# EAGLE design powersupply_vol6 (EAGLE 9.6.2)
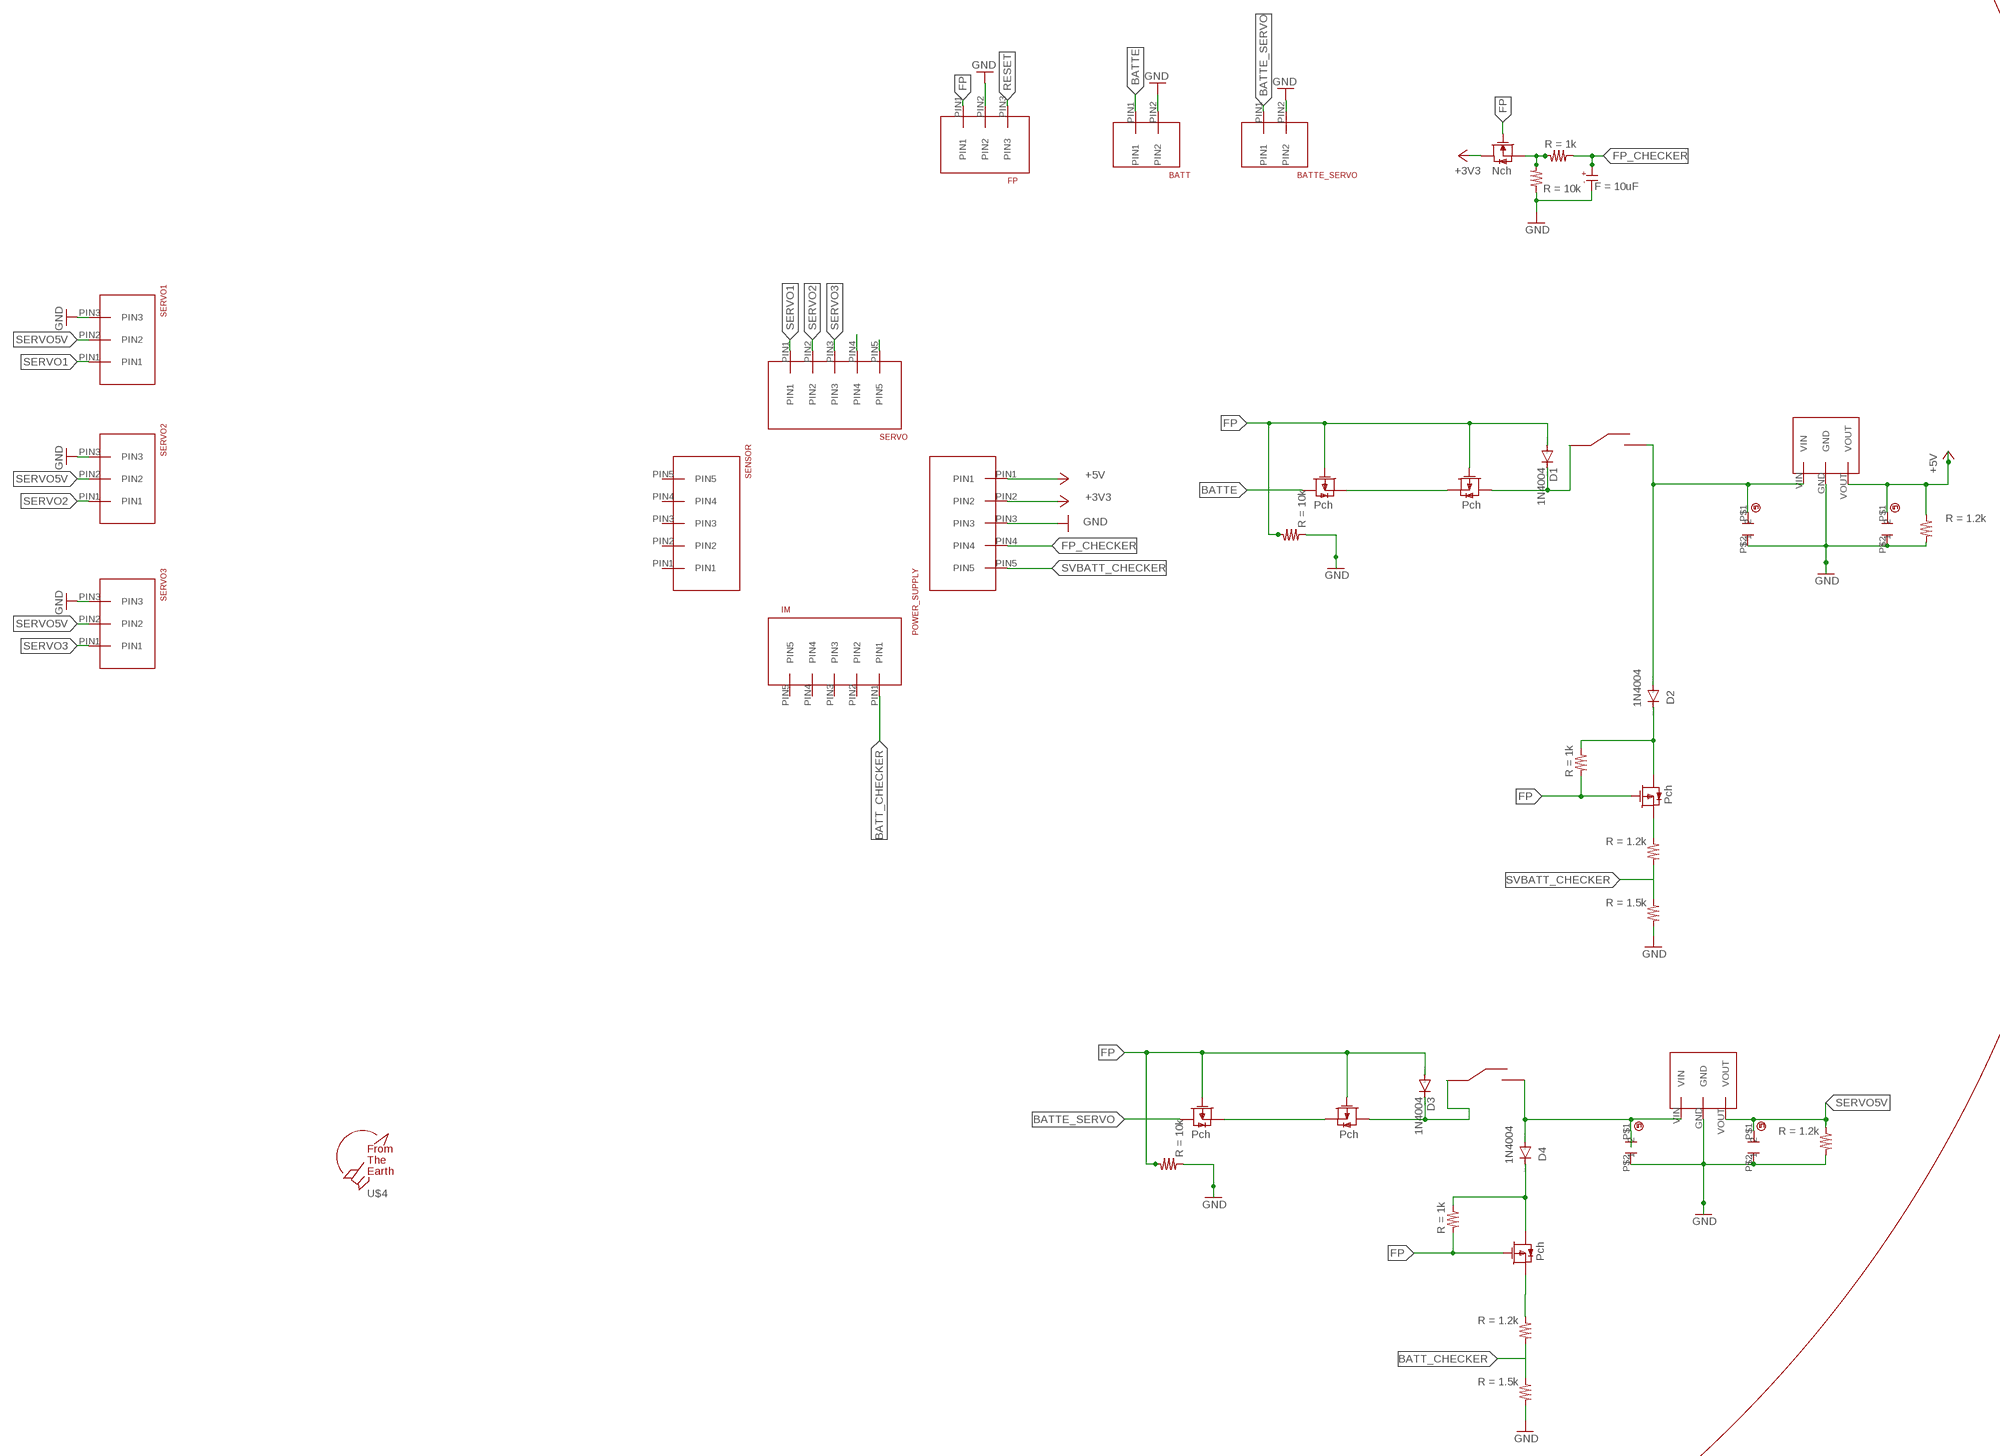
[diagram p0: schematic, sheet 1]

## Parts
BATT  2PIN  [2PIN]
BATTE_SERVO  2PIN  [2PIN]
C1  CAPACITOR-ELECTROLYTIC_1  [CAPACITOR-ELECTROLYTIC_1]
CERAMIC_CAPACITOR3  CERAMIC_CAPACITOR  [CERAMIC_CAPACITOR]
CERAMIC_CAPACITOR4  CERAMIC_CAPACITOR  [CERAMIC_CAPACITOR]
CERAMIC_CAPACITOR5  CERAMIC_CAPACITOR  [CERAMIC_CAPACITOR]
CERAMIC_CAPACITOR6  CERAMIC_CAPACITOR  [CERAMIC_CAPACITOR]
D1  1N4004  [DO41-10]
D2  1N4004  [DO41-10]
D3  1N4004  [DO41-10]
D4  1N4004  [DO41-10]
FP  3PIN  [3PIN]
IM  5PIN  [5PIN]
POWER_SUPPLY  5PIN  [5PIN]
R1  1.5k  RESISTER  [REGISTER]
R2  RESISTER  [REGISTER]
R3  RESISTER  [REGISTER]
R4  1.5k  RESISTER  [REGISTER]
R5  RESISTER  [REGISTER]
R6  RESISTER  [REGISTER]
R7  RESISTER  [REGISTER]
R8  RESISTER  [REGISTER]
R9  RESISTER  [REGISTER]
R10  RESISTER  [REGISTER]
R11  RESISTER  [REGISTER]
R12  RESISTER  [REGISTER]
SENSOR  5PIN  [5PIN]
SERVO  5PIN  [5PIN]
SERVO1  3PIN  [3PIN]
SERVO2  3PIN  [3PIN]
SERVO3  3PIN  [3PIN]
U$1  2SJ681-PCH  [2SJ681]
U$2  SLIDESWITCH  [SLIDESWITCH]
U$3  SLIDESWITCH  [SLIDESWITCH]
U$4  F.T.E.LOGO  [LOGO]
U$5  2SJ681-PCH  [2SJ681]
U$8  2SK4017-NCH  [2SK4017]
U$12  2SJ681-PCH  [2SJ681]
U$13  2SJ681-PCH  [2SJ681]
U$14  M78AR05-1  [M78AR05-1]
U$30  2SJ681-PCH  [2SJ681]
U$31  2SJ681-PCH  [2SJ681]
U$32  M78AR05-1  [M78AR05-1]

## Nets
+3V3: POWER_SUPPLY.PIN2 U$8.DRAIN
+5V: CERAMIC_CAPACITOR5.P$1 POWER_SUPPLY.PIN1 R11.A U$32.VOUT
BATT_CHECKER: IM.PIN1 R1.A R3.B
BATTE: BATT.PIN1 U$30.DRAIN
BATTE_SERVO: BATTE_SERVO.PIN1 U$13.DRAIN
FP: D1.A D3.A FP.PIN1 R2.B R5.B R7.B R8.B U$1.GATE U$5.GATE U$8.GATE U$12.GATE U$13.GATE U$30.GATE U$31.GATE
FP_CHECKER: C1.KS POWER_SUPPLY.PIN4 R10.A
GND: BATT.PIN2 BATTE_SERVO.PIN2 C1.AN CERAMIC_CAPACITOR3.P$2 CERAMIC_CAPACITOR4.P$2 CERAMIC_CAPACITOR5.P$2 CERAMIC_CAPACITOR6.P$2 FP.PIN2 POWER_SUPPLY.PIN3 R1.B R2.A R4.B R5.A R9.A R11.B R12.B SERVO1.PIN3 SERVO2.PIN3 SERVO3.PIN3 U$14.GND U$32.GND
N$1: D2.C R7.A U$1.DRAIN
N$2: U$12.SOURCE U$13.SOURCE
N$3: R6.A U$1.SOURCE
N$4: D4.C R8.A U$5.DRAIN
N$5: R9.B R10.B U$8.SOURCE
N$6: CERAMIC_CAPACITOR4.P$1 D4.A U$3.C U$14.VIN
N$7: SERVO.PIN4
N$8: SERVO.PIN5
N$9: R3.A U$5.SOURCE
N$10: D1.C U$2.A U$31.DRAIN
N$11: D3.C U$3.A U$12.DRAIN
N$22: U$30.SOURCE U$31.SOURCE
N$24: CERAMIC_CAPACITOR6.P$1 D2.A U$2.C U$32.VIN
RESET: FP.PIN3
SERVO1: SERVO1.PIN1 SERVO.PIN1
SERVO2: SERVO2.PIN1 SERVO.PIN2
SERVO3: SERVO3.PIN1 SERVO.PIN3
SERVO5V: CERAMIC_CAPACITOR3.P$1 R12.A SERVO1.PIN2 SERVO2.PIN2 SERVO3.PIN2 U$14.VOUT
SVBATT_CHECKER: POWER_SUPPLY.PIN5 R4.A R6.B
Unconnected: IM.PIN2 IM.PIN3 IM.PIN4 IM.PIN5 SENSOR.PIN1 SENSOR.PIN2 SENSOR.PIN3 SENSOR.PIN4 SENSOR.PIN5 U$2.B U$3.B

## Library data of the parts
BATT BATTE_SERVO = connectors:2PIN
C1 = normal capacitor:CAPACITOR-ELECTROLYTIC_1; F: 10uF
CERAMIC_CAPACITOR3-CERAMIC_CAPACITOR6 = capacitor:CERAMIC_CAPACITOR: ceramic_capacitor
D1-D4 = diode:1N4004: DIODE general purpose rectifier, 1 A
FP SERVO1-SERVO3 = connectors:3PIN
IM POWER_SUPPLY SENSOR SERVO = connectors:5PIN
R1 R4 = normal register:RESISTER; R: 1.5k
R2 R5 R9 = normal register:RESISTER; R: 10k
R3 R6 R11 R12 = normal register:RESISTER; R: 1.2k
R7 R8 R10 = normal register:RESISTER; R: 1k
U$1 U$5 U$12 U$13 U$30 U$31 = MOSFET:2SJ681-PCH
U$2 U$3 = SLIDESWITCH:SLIDESWITCH
U$4 = logo:F.T.E.LOGO
U$8 = MOSFET:2SK4017-NCH
U$14 U$32 = M78AR05-1:M78AR05-1

## Board
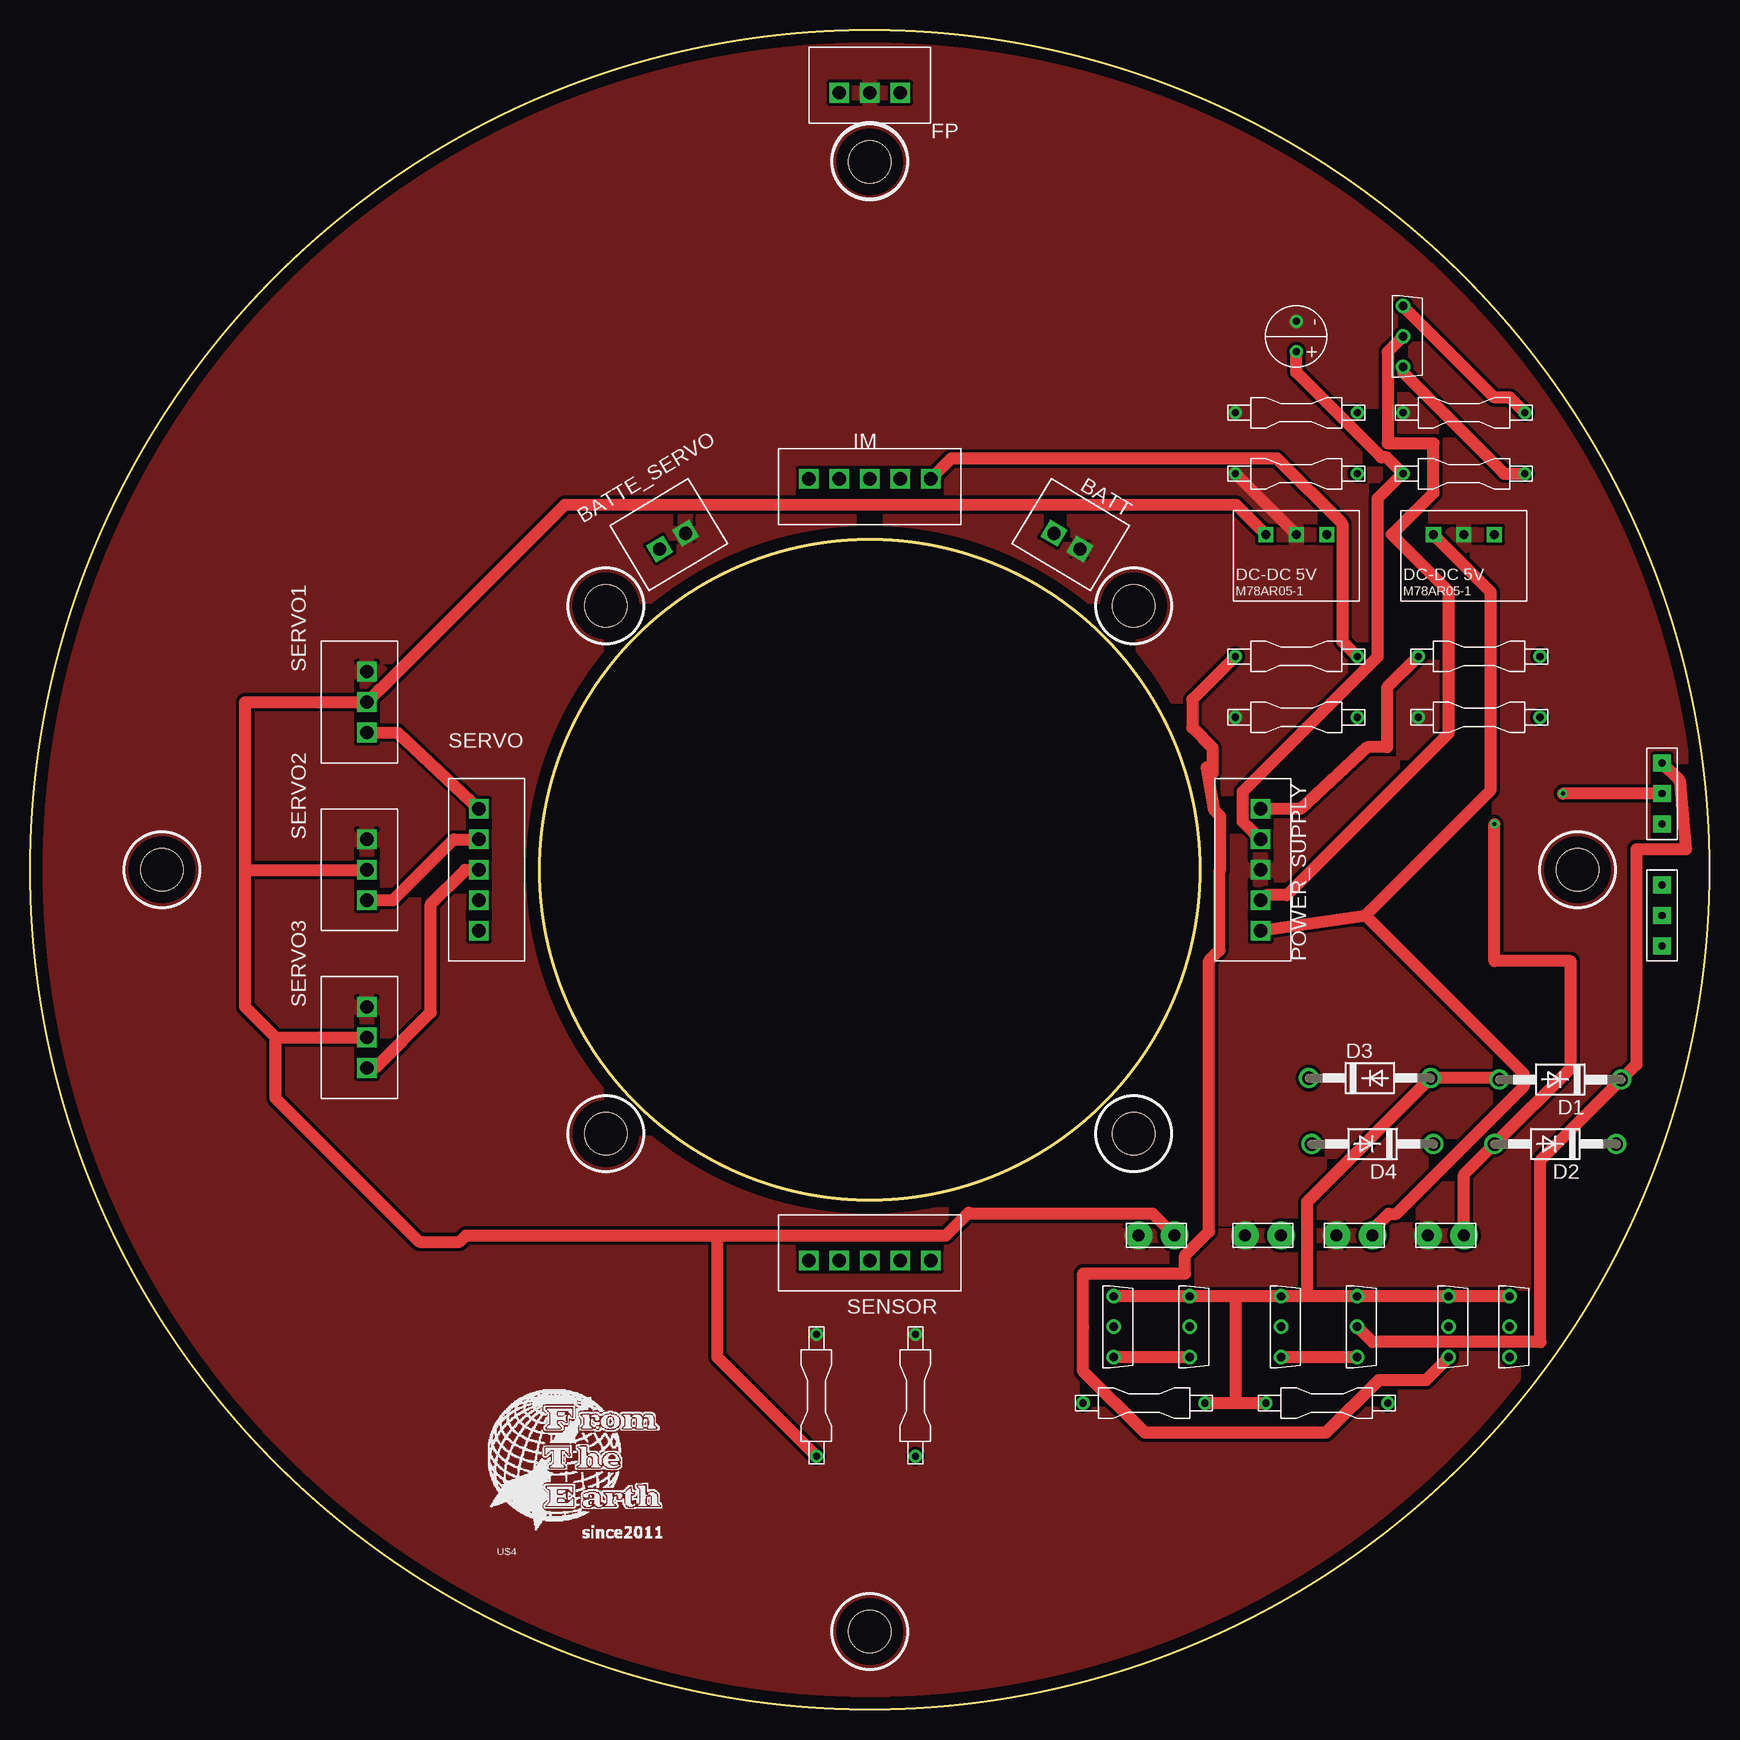
[diagram p1: board, top side]
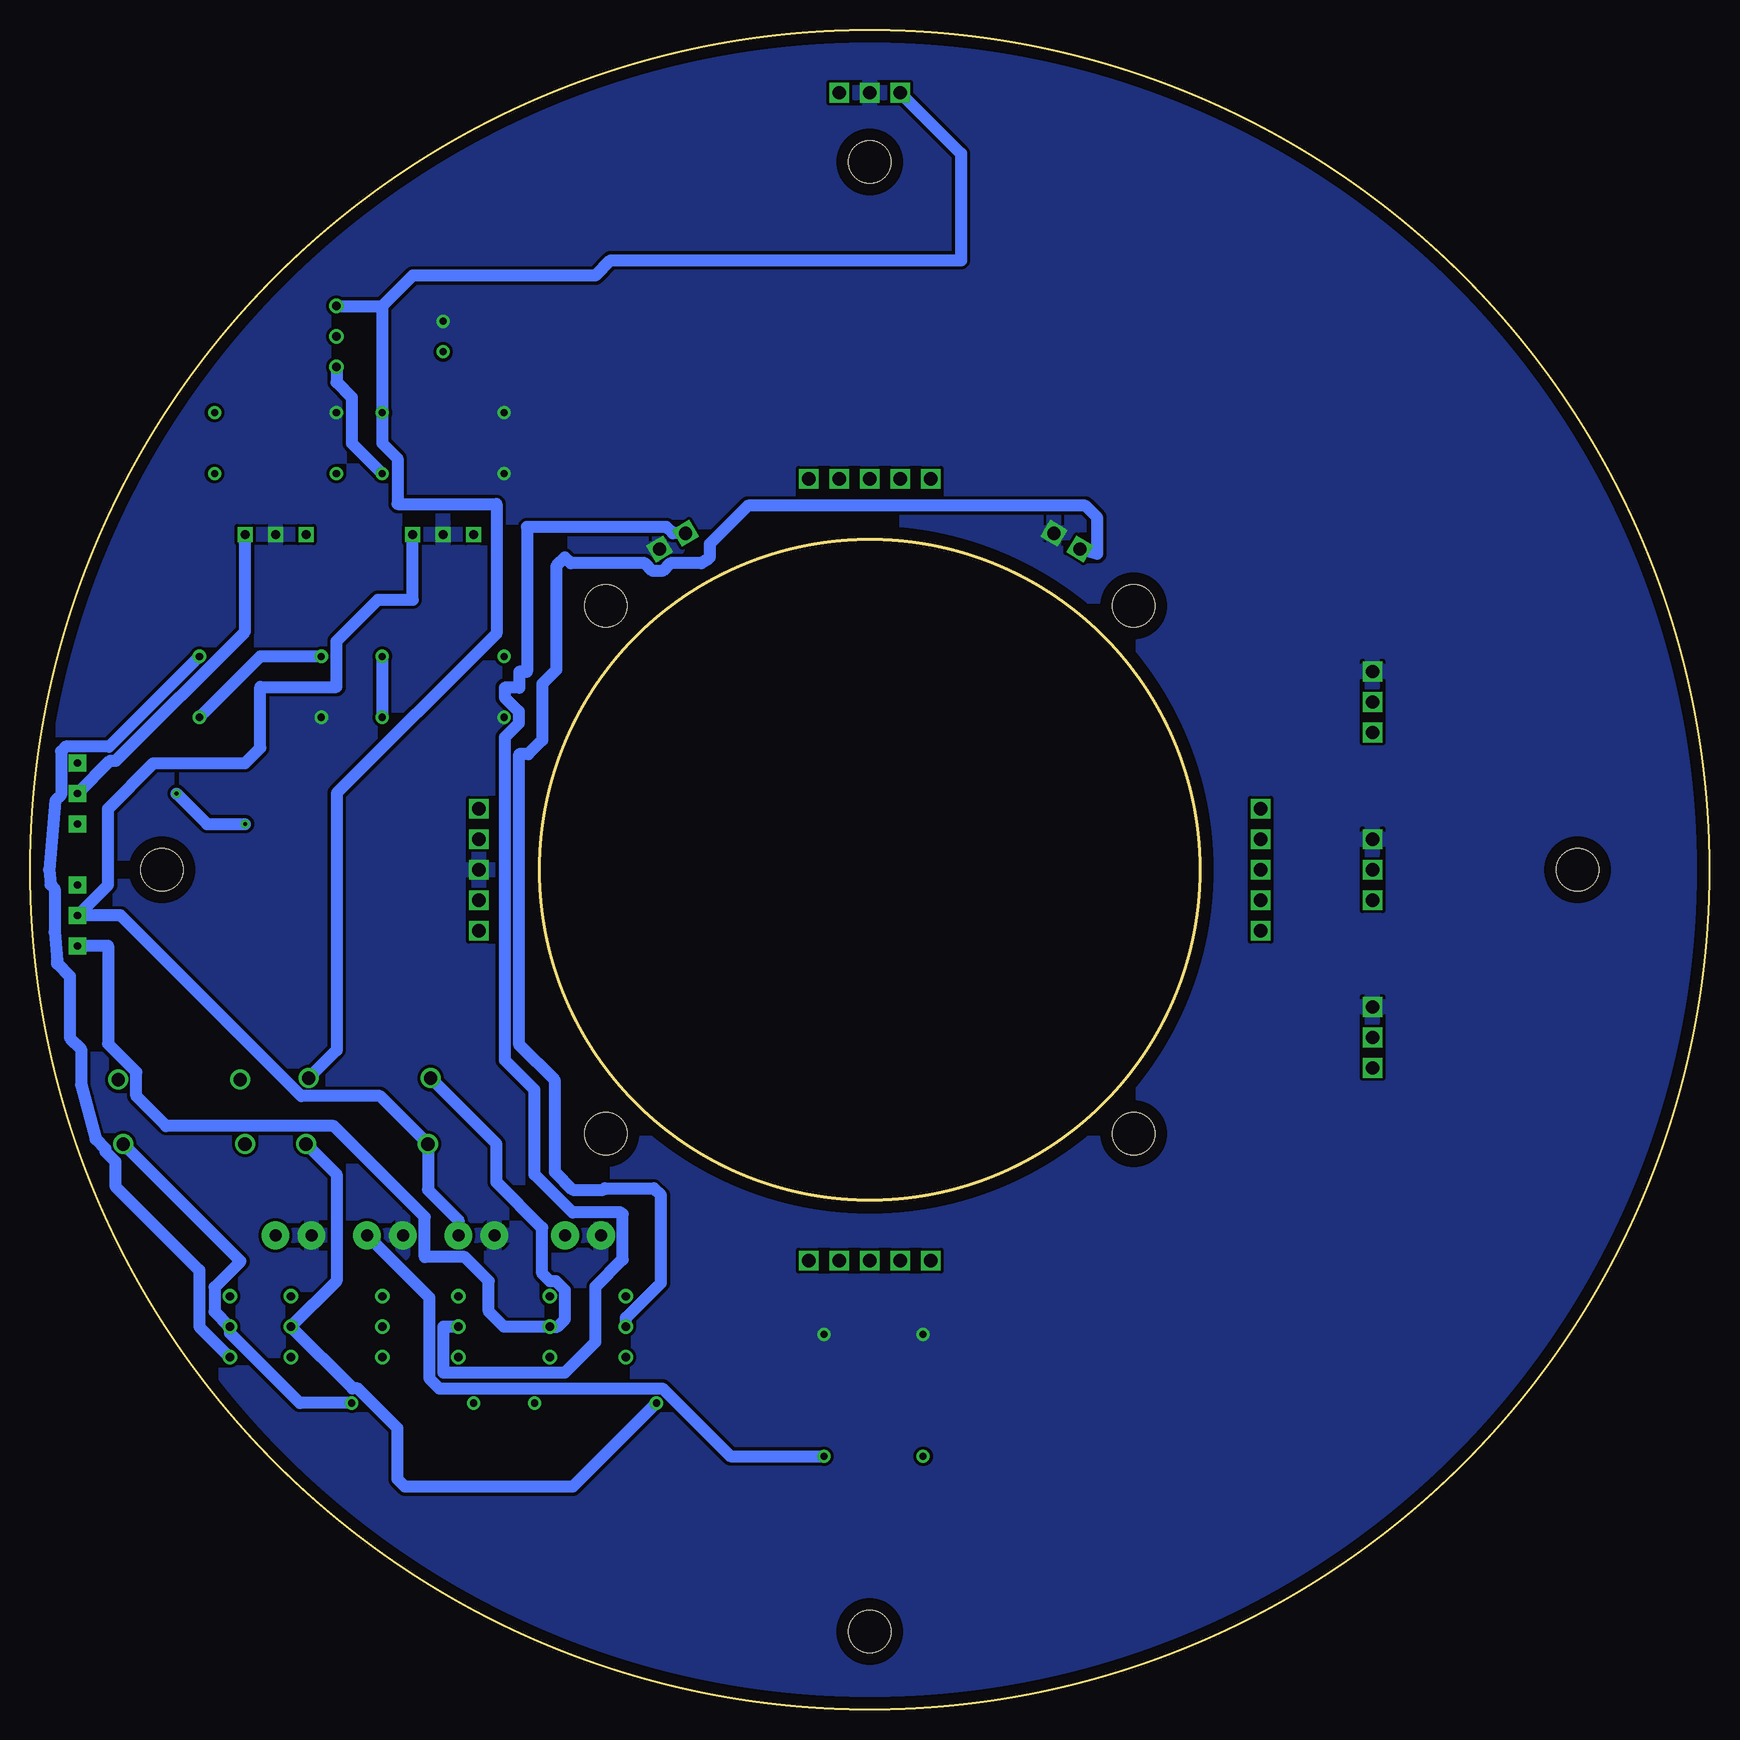
[diagram p2: board, bottom side, seen from below]

Size 140 x 140 mm. Coordinates in mm from the lower left corner, seen from the top.
Outline: circle at 70,70 radius 70
Outline: circle at 70,70 radius 27.5
Copper layers (1*16): Top 0.035mm / dielectric 1.5mm / Bottom 0.035mm
Design rules "default": minimum track width 6mil, minimum drill 0.35mm, track to track 6mil, track to pad 6mil, pad to pad 6mil, via to via 6mil, smd to smd 6mil, copper to edge 40mil, drill to drill 6mil, minimum pad ring 10mil, minimum via ring 8mil, stop-mask expansion 4mil, vias tented up to drill 0mil, thermal gap 10mil
Holes 3.5 mm at 48,48 92,48 48,92 92,92 70,6.5 11,70 70,129 129,70

### Footprints (pad centres in the part's own frame; a part is rotated, then mirrored left to right if it is on the bottom)
2PIN = drill 1.1 square: PIN1 -1.27,-5.08; PIN2 1.27,-5.08
CAPACITOR-ELECTROLYTIC_1 = drill 0.6: AN -1.27,0; KS 1.27,0
CERAMIC_CAPACITOR = drill 1 pad 2.3: P$1 0,0; P$2 0,3
DO41-10 = drill 1.118: A 5.08,0; C -5.08,0
3PIN = drill 1.1 square: PIN1 -2.54,-5.08; PIN2 0,-5.08; PIN3 2.54,-5.08
5PIN = drill 1.1 square: PIN1 -5.08,-5.08; PIN2 -2.54,-5.08; PIN3 0,-5.08; PIN4 2.54,-5.08; PIN5 5.08,-5.08
REGISTER = drill 0.6: A -5.08,0; B 5.08,0
2SJ681 = drill 0.7: DRAIN 0,0; GATE 2.54,0; SOURCE -2.54,0
SLIDESWITCH = drill 0.6 pad 1.422 square: A 0,0; B 5.08,0; C 2.54,0
2SK4017 = drill 0.7: DRAIN 0,0; GATE 2.54,0; SOURCE -2.54,0
M78AR05-1 = drill 0.75 pad 1.27 square: GND 0,0; VIN 2.54,0; VOUT -2.54,0

### Placement (x,y rotation side)
BATT  89.05,101.75 329 top
BATTE_SERVO  50.95,101.75 31 top
C1  105.56,114.45 270 top
CERAMIC_CAPACITOR3  95.4,39.52 90 top
CERAMIC_CAPACITOR4  104.29,39.52 90 top
CERAMIC_CAPACITOR5  111.91,39.52 90 top
CERAMIC_CAPACITOR6  119.53,39.52 90 top
D1  127.56,52.51 180 top
D2  127.15,47.14 180 top
D3  111.69,52.63 0 top
D4  111.91,47.14 180 top
FP  70,139.85 0 top
IM  70,97.5 180 top
POWER_SUPPLY  97.5,70 90 top
R1  105.56,82.7 180 top
R2  119.53,108.1 0 top
R3  105.56,87.78 0 top
R4  120.8,82.7 180 top
R5  105.56,108.1 0 top
R6  120.8,87.78 180 top
R7  108.1,25.55 180 top
R8  92.86,25.55 0 top
R9  105.56,103.02 0 top
R10  119.53,103.02 0 top
R11  73.81,26.19 90 top
R12  65.56,26.19 90 top
SENSOR  70,42.5 0 top
SERVO  42.5,70 270 top
SERVO1  23.01,83.97 90 top
SERVO2  23.01,70 90 top
SERVO3  23.01,56.03 90 top
U$1  123.34,31.9 90 top
U$2  136.04,78.89 270 top
U$3  136.04,63.65 90 top
U$4  37.62,12.85 0 top
U$5  118.26,31.9 90 top
U$8  114.45,114.45 90 top
U$12  96.67,31.9 90 top
U$13  90.32,31.9 90 top
U$14  105.56,97.94 0 top
U$30  104.29,31.9 90 top
U$31  110.64,31.9 90 top
U$32  119.53,97.94 0 top

### Tracks (layer width: path | path; a pad name or v marks a point on that pad's centre or on a via)
+3V3
  Top 1.016: POWER_SUPPLY.PIN2 103.08,67.88 104.75,67.88 118.26,81.39 118.26,93.2 113.52,97.94 116.99,101.41 116.99,105.56 113.18,105.56 113.18,113.18 U$8.DRAIN
+5V
  Top 1.016: POWER_SUPPLY.PIN1 111.31,66.19 | 111.31,66.19 124.51,52.98 124.51,51.94 113.9,41.33 113.24,41.33 111.91,40 CERAMIC_CAPACITOR5.P$1 | 111.31,66.19 121.77,76.65 121.77,93.16 U$32.VOUT
  Bottom 1.016: CERAMIC_CAPACITOR5.P$1 106.73,34.34 106.73,27.61 105.89,26.76 87.28,26.76 81.62,21.1 R11.A
BATT_CHECKER
  Top 1.016: R3.B 109.4,89.03 109.4,98.85 103.95,104.29 76.79,104.29 IM.PIN1
  Bottom 1.016: R3.B R1.A
BATTE
  Bottom 1.016: U$30.DRAIN 105.56,31.9 105.56,28.09 95.4,28.09 92.86,30.63 92.86,35.23 90.59,37.5 90.59,41.27 90.74,41.42 94.77,41.42 97.94,44.6 97.94,51.66 100.42,54.14 100.42,81.04 99.27,82.2 99.27,83.2 100.42,84.36 100.42,85.18 99.22,85.18 99.22,86.5 98.58,86.5 98.58,98.58 86.95,98.58 86.42,98.05 BATT.PIN1
BATTE_SERVO
  Bottom 1.016: U$13.DRAIN 90.32,32.65 87.41,35.56 87.41,42.86 88.01,43.46 92.09,43.46 92.21,43.33 94.77,43.33 96.24,44.8 96.24,52.42 99.21,55.39 99.21,79.63 98.47,79.63 97.31,80.8 97.31,85.49 96.14,86.66 96.14,95.3 95.4,96.03 94.91,95.55 88.74,95.55 88.1,94.9 87.27,94.9 86.63,95.55 84.05,95.55 83.51,95.86 83.34,96.03 83.34,97.16 80.16,100.34 52.02,100.34 51.03,99.35 51.03,96.33 BATTE_SERVO.PIN1
FP
  Top 1.016: 100.48,34.44 U$30.GATE 106.47,34.44 | 100.48,34.44 U$12.GATE U$13.GATE | 106.47,34.44 U$31.GATE U$5.GATE U$1.GATE | D1.A 122.36,52.63 D3.A 106.47,42.33 106.47,34.44 | R2.B 123.34,109.37 122.07,109.37 U$8.GATE | R8.B 100.48,25.55 | 100.48,25.55 R7.B | 100.48,34.44 100.48,25.55
  Bottom 1.016: D3.A 114.42,54.98 114.42,76.38 101.11,89.69 101.11,100.48 109.37,100.48 109.37,104.29 110.64,105.56 R5.B 110.64,116.99 | FP.PIN1 62.38,129.69 62.38,120.8 91.59,120.8 92.86,119.53 108.1,119.53 110.64,116.99 | U$8.GATE 110.64,116.99
FP_CHECKER
  Top 1.016: C1.KS 105.56,111.46 112.63,104.39 113.08,104.39 R10.A 114.4,103.02 112.35,100.96 112.35,87.77 101.09,76.52 101.09,73.98 101.48,73.59 101.53,73.59 POWER_SUPPLY.PIN4
GND
  Top 1.016: R9.A U$14.GND
  pour Bottom (isolate 0.254): 0.15,70 0.15,69.7 arc45 20.59,20.35 26.82,14.12 arc45 63.61,-1.12 73.81,-1.12 arc45 117.17,16.84 123.34,23.01 arc45 141.12,65.93 141.12,75.08 arc45 124.06,116.27 118.26,122.07 arc45 72.27,141.12 68.73,141.12 67.73,141.12 arc45 21.74,122.07 20.59,120.92 arc45 0.15,71.57
  pour Top (isolate 0.254): 0.15,70 0.15,68.26 arc45 20.47,19.2 arc45 69.53,-1.12 75.08,-1.12 arc45 116.27,15.94 125.88,25.55 arc45 141.12,62.34 141.12,72.54 arc45 121.36,120.24 115.72,125.88 arc45 78.93,141.12 68.73,141.12 arc45 21.03,121.36 19.2,119.53 arc45 0.15,73.54
N$1
  Bottom 1.016: R7.A 117.51,25.55 123.34,31.38 U$1.DRAIN 124.61,33.17 124.61,35.19 122.45,37.36 D2.C
N$2
  Top 1.016: U$12.SOURCE U$13.SOURCE
N$3
  Bottom 1.016: R6.A 133.4,80.26 137.03,80.26 137.41,79.88 137.41,76.25 137.89,75.77 138.4,70 138.29,68.75 137.94,68.41 137.94,64.8 137.74,62.4 137.74,62.17 136.68,61.11 136.68,56 135.74,55.06 135.74,52.07 134.53,47.55 133.73,46.75 133.73,46.52 132.88,45.67 132.88,43.62 125.88,36.62 125.88,31.9 U$1.SOURCE
N$4
  Bottom 1.016: D4.C 114.46,44.61 114.46,35.7 U$5.DRAIN 113.12,26.76 112.68,26.76 109.37,23.46 109.37,19.2 108.73,18.56 94.77,18.56 R8.A
N$5
  Top 1.016: R10.B 122.89,103.02 114.45,111.46 U$8.SOURCE
  Bottom 1.016: U$8.SOURCE 114.45,110.64 113.18,109.37 113.18,105.56 R9.B
N$6
  Bottom 1.016: U$14.VIN 108.1,92.5 111,92.5 114.45,89.05 114.45,85.24 120.8,85.24 120.8,80.16 122.07,78.89 129.69,78.89 133.5,75.08 133.5,68.73 U$3.C 132.44,66.19 117.39,51.13 110.82,51.13 D4.A 106.83,43.33 104.29,40.79 CERAMIC_CAPACITOR4.P$1
N$9
  Top 1.016: U$5.SOURCE 116.35,27.45 112.43,27.45 108.04,23.07 92.92,23.07 87.79,28.2 87.79,31.89 87.78,31.9 87.78,36.34 96.29,36.34 96.29,37.85 98.27,39.83 98.27,62.44 99.15,63.31 99.15,69.94 99.21,70 99.21,74.44 98.73,74.92 98.1,78.53 98.58,78.05 98.58,80.16 96.89,81.84 96.89,84.19 R3.A
N$10
  Top 1.016: U$2.A 137.56,77.38 138.05,71.72 133.91,71.72 133.91,53.77 D1.C 125.91,45.77 125.91,30.63 111.91,30.63 U$31.DRAIN
N$11
  Bottom 1.016: D3.C 101.11,47.14 101.11,43.97 97.31,40.16 97.31,36.34 96.66,35.7 96.15,35.7 95.4,34.96 95.4,32.53 96.03,31.9 U$12.DRAIN 100.48,31.9 101.76,33.18 101.76,35.71 103.75,37.71 107.1,37.71 107.1,41.06 114.68,48.64 128.65,48.64 131.14,51.13 131.14,53.13 133.5,55.48 133.5,63.65 U$3.A
N$22
  Top 1.016: U$31.SOURCE U$30.SOURCE
N$24  (via drill 0.35)
  Top 1.016: CERAMIC_CAPACITOR6.P$1 119.53,44.6 D2.A 128.42,53.49 128.42,62.38 122.07,62.38 v122.07,73.81 | U$2.C v127.78,76.35
  Bottom 1.016: U$2.C 133.3,79.09 132.85,79.09 122.07,89.87 U$32.VIN | v127.78,76.35 125.25,73.81 v122.07,73.81
SERVO1
  Top 1.016: SERVO1.PIN1 30.63,81.43 SERVO.PIN1
SERVO2
  Top 1.016: SERVO2.PIN1 30.25,67.46 35.33,72.54 SERVO.PIN2
SERVO3
  Top 1.016: SERVO3.PIN1 28.81,53.49 33.41,58.09 33.41,67.15 36.26,70 SERVO.PIN3
SERVO5V
  Top 1.016: 20.47,56.03 20.47,50.95 32.44,38.98 35.8,38.98 36.34,39.52 57.3,39.52 | 17.93,70 17.93,58.57 20.47,56.03 | 17.93,70 17.93,83.97 SERVO1.PIN2 29.15,85.03 29.19,85.03 44.59,100.42 80.8,100.42 100.54,100.42 U$14.VOUT | 20.47,56.03 SERVO3.PIN2 | 17.93,70 SERVO2.PIN2 | 57.3,39.52 76.35,39.52 78.25,41.42 78.35,41.33 93.59,41.33 CERAMIC_CAPACITOR3.P$1 | R12.A 57.3,29.36 57.3,39.52
SVBATT_CHECKER
  Top 1.016: R6.B 113.12,85.18 113.12,80.22 111.49,80.22 105.92,75.08 POWER_SUPPLY.PIN5
  Bottom 1.016: R6.B 120.8,87.78 R4.A